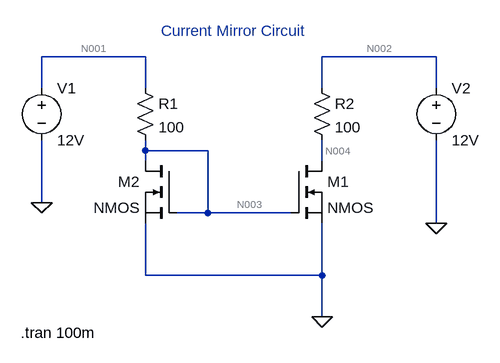
[diagram p0: schematic CurrentMirror.asc]
CurrentMirror.asc, the LTspice schematic file:
Version 4
SHEET 1 880 680
WIRE 80 -16 -80 -16
WIRE 528 -16 352 -16
WIRE -80 32 -80 -16
WIRE 80 32 80 -16
WIRE 352 32 352 -16
WIRE 528 32 528 -16
WIRE 80 128 80 112
WIRE 176 128 80 128
WIRE 80 144 80 128
WIRE 352 144 352 112
WIRE -80 208 -80 112
WIRE 176 224 176 128
WIRE 176 224 128 224
WIRE 304 224 176 224
WIRE 528 240 528 112
WIRE 80 320 80 240
WIRE 352 320 352 240
WIRE 352 320 80 320
WIRE 352 384 352 320
FLAG 352 384 0
FLAG -80 208 0
FLAG 528 240 0
SYMBOL nmos 304 144 R0
SYMATTR InstName M1
SYMBOL nmos 128 144 M0
SYMATTR InstName M2
SYMBOL res 64 16 R0
SYMATTR InstName R1
SYMATTR Value 100
SYMBOL res 336 16 R0
SYMATTR InstName R2
SYMATTR Value 100
SYMBOL voltage -80 16 R0
WINDOW 123 0 0 Left 0
WINDOW 39 0 0 Left 0
SYMATTR InstName V1
SYMATTR Value 12V
SYMBOL voltage 528 16 R0
WINDOW 123 0 0 Left 0
WINDOW 39 0 0 Left 0
SYMATTR InstName V2
SYMATTR Value 12V
TEXT -112 408 Left 2 !.tran 100m
TEXT 104 -56 Left 2 ;Current Mirror Circuit

The netlist it stands for:
* CurrentMirror.asc
M1 N004 N003 0 0 NMOS
M2 N003 N003 0 0 NMOS
R1 N001 N003 100
R2 N002 N004 100
V1 N001 0 12V
V2 N002 0 12V
.model NMOS NMOS
.model PMOS PMOS
.lib standard.mos
.tran 100m
* Current Mirror Circuit
.backanno
.end

* Results of the author's LTspice run, read from the files saved beside the schematic
* Operating Point, zero values left out:
*   V(n004) = 11.86 V
*   V(n003) = 11.86 V
*   V(n001) = 12 V
*   V(n002) = 12 V
*   Id(M1) = 1.406 mA
*   Ib(M1) = -11.87 pA
*   Is(M1) = -1.406 mA
*   Id(M2) = 1.406 mA
*   Ib(M2) = -11.87 pA
*   Is(M2) = -1.406 mA
*   I(R1) = 1.406 mA
*   I(R2) = 1.406 mA
*   I(V1) = -1.406 mA
*   I(V2) = -1.406 mA